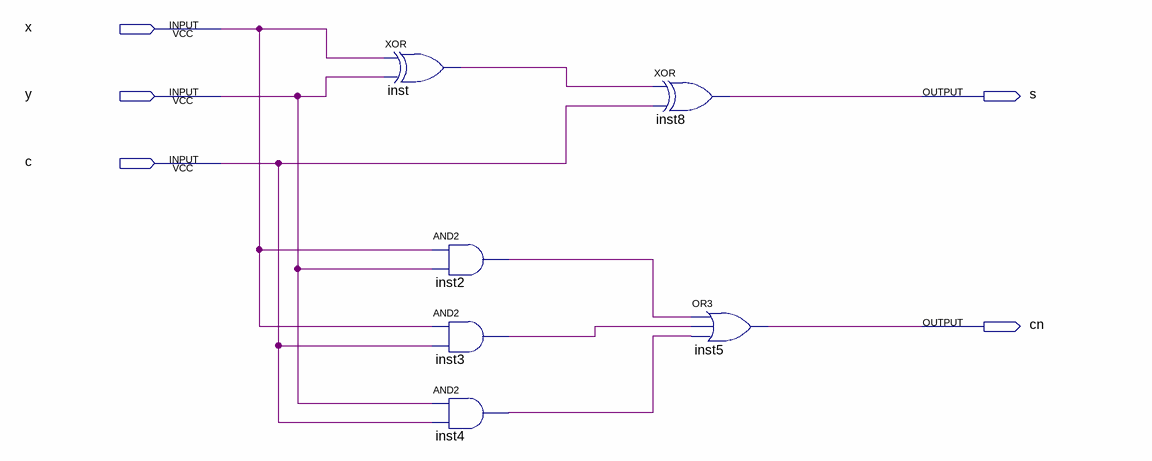
[diagram p0: schematic sheet]
// Quartus schematic aula05.bdf as structural Verilog: 6 symbols, 5 pins
module aula05 (
  input  x,
  input  y,
  input  c,
  output s,
  output cn
);

  wire inst2_out, inst3_out, inst4_out, inst_out;

  xor inst (inst_out, x, y);
  and inst2 (inst2_out, x, y);
  and inst3 (inst3_out, x, c);
  and inst4 (inst4_out, y, c);
  xor inst8 (s, inst_out, c);
  or inst5 (cn, inst2_out, inst3_out, inst4_out);
endmodule
